# EasyEDA Pro project TF_MUX.epro, board PCB5
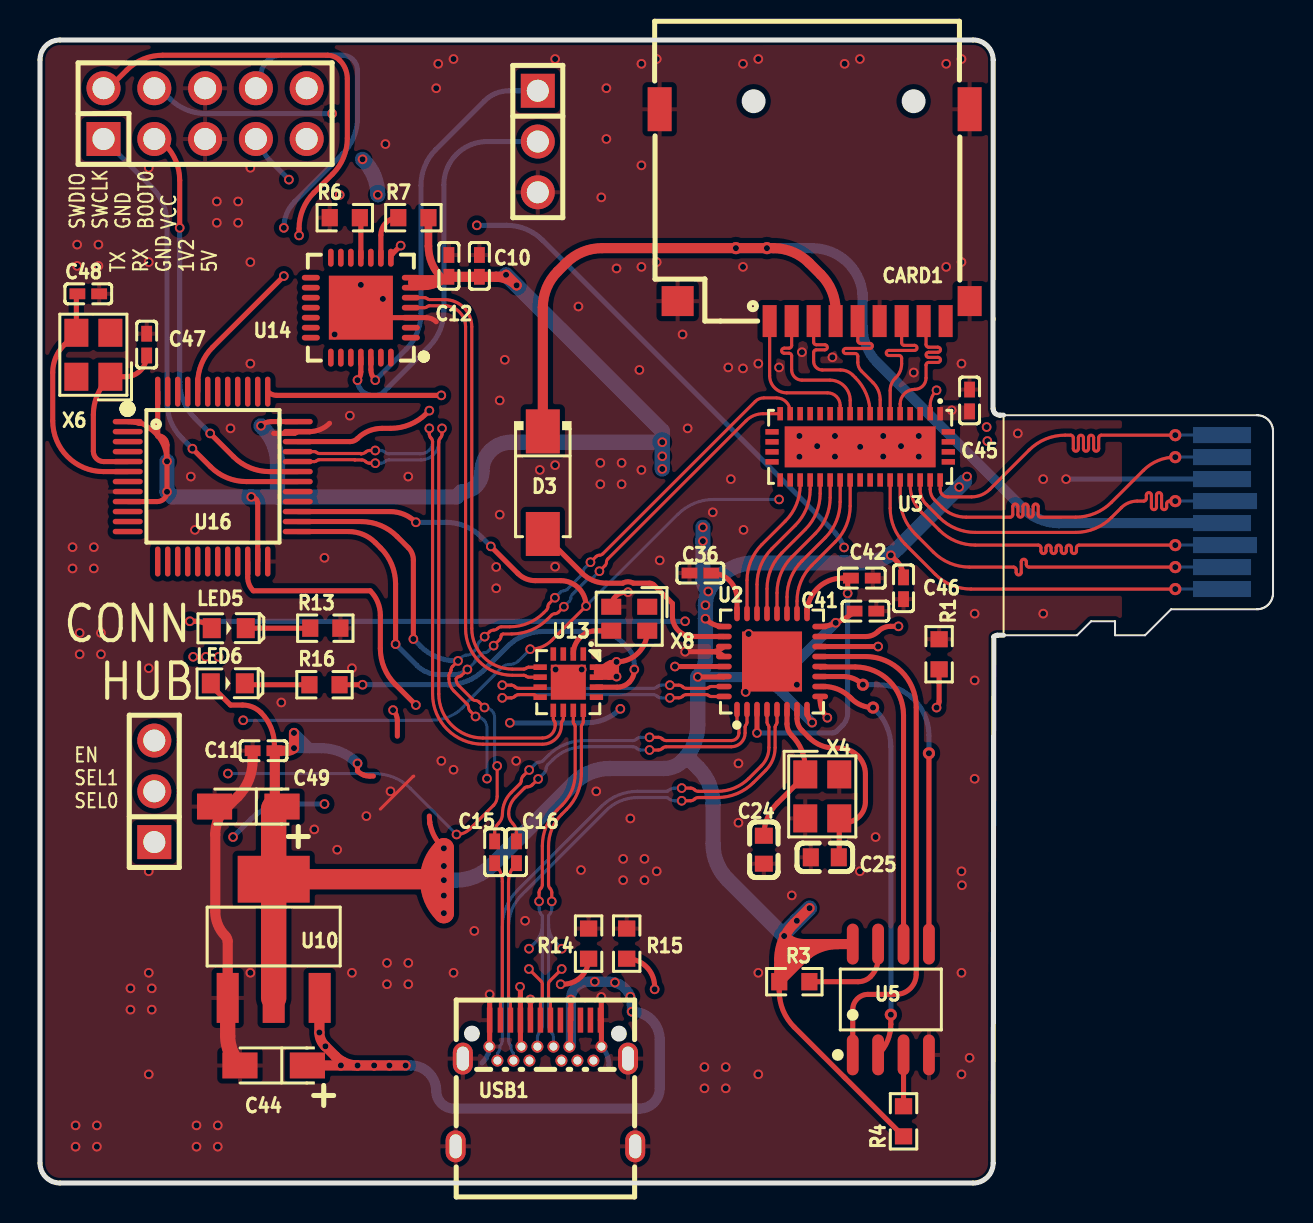
[diagram p1: board, top side]
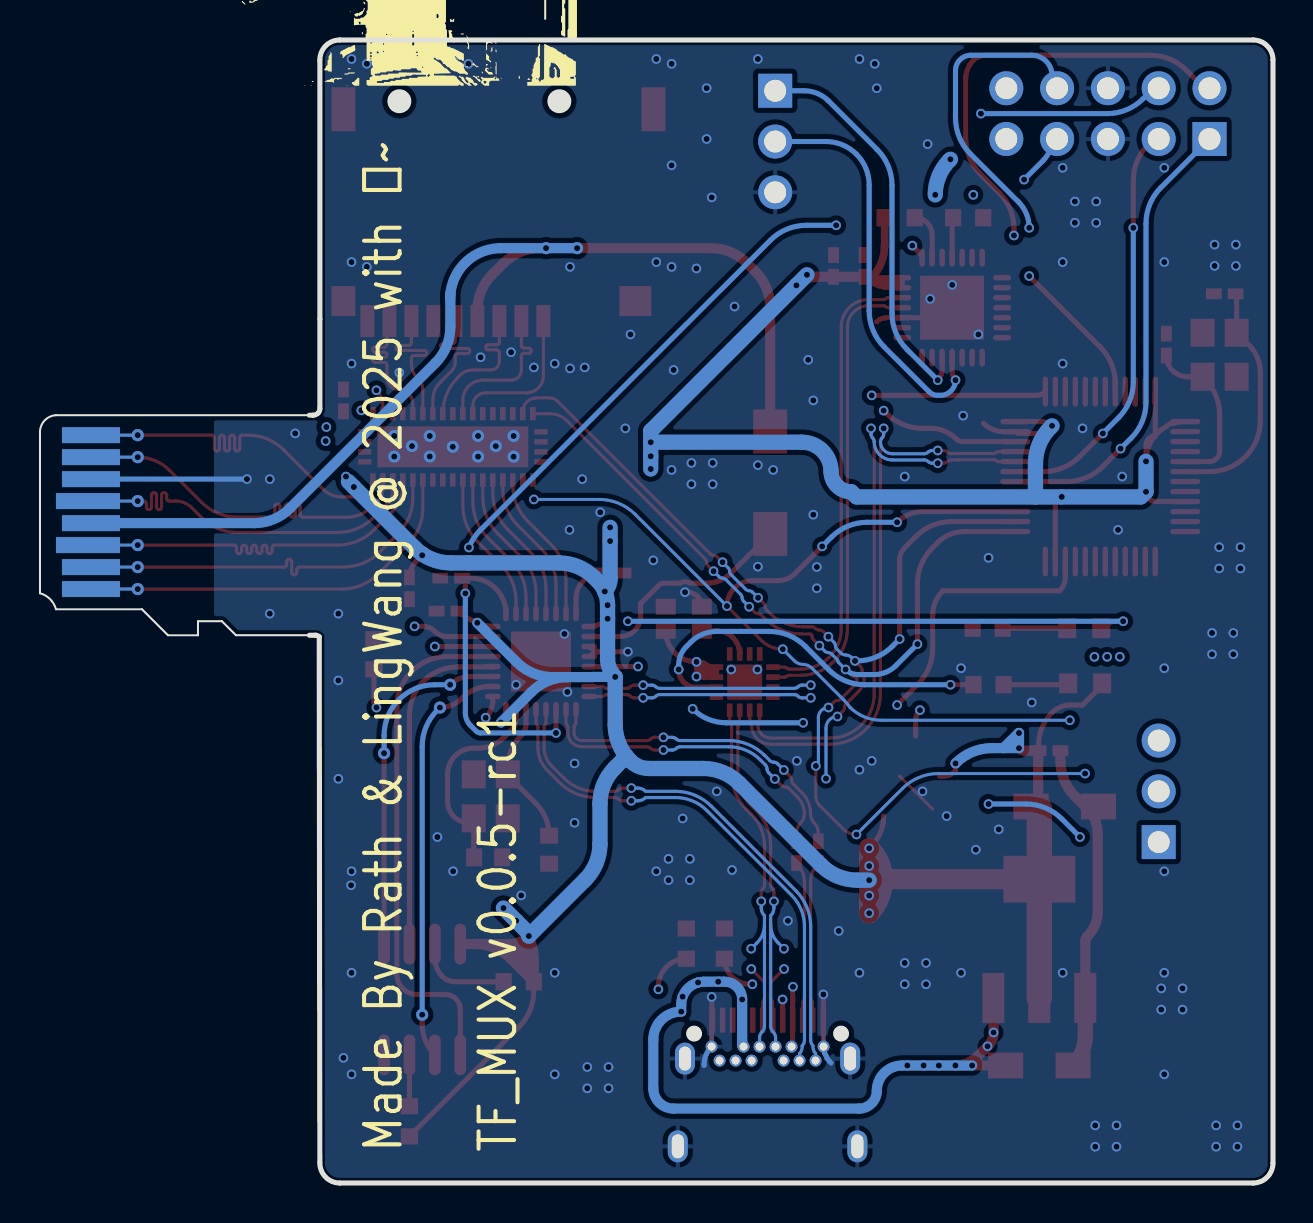
[diagram p2: board, bottom side, seen from below]

Outline 61.66 x 57.19 mm; copper layers: Top Layer, Inner1, Inner2, Bottom Layer. Coordinates in mm from the lower left corner of the outline.
Outline path: 48.18,38.42 48,38.42 arc(47.87,38.44) 47.75,38.52 arc(47.68,38.62) 47.66,38.75 47.66,43.23 47.66,56.19 arc(47.37,56.9) 46.66,57.19 1,57.19 arc(0.29,56.9) 0,56.19 0,1 arc(0.29,0.29) 1,0 46.66,0 arc(47.37,0.29) 47.66,1 47.69,27.33 arc(47.78,27.39) 47.88,27.41 48.18,27.41
Stack: Top Layer 0.035mm 外层铜厚1oz / Dielectric1 0.2104mm 7628 RC49% 8.6mil / Inner1 0.0152mm 内层铜厚 / Dielectric2 1.065mm 1.1mm H/HOZ Copper / Inner2 0.0152mm 内层铜厚 / Dielectric3 0.2104mm 7628 RC49% 8.6mil / Bottom Layer 0.035mm 外层铜厚1oz

## Design rules (mm)
net $1N466: DP1
net RD_TX+: RD_TX
net $1N465: DP1
net RD_TX-: RD_TX
net RD_RX+: RD_RX
net RD_RX-: RD_RX
net RD_D-: RD_D
net RD_D+: RD_D
net HS_D-: HS_D
net HS_D+: HS_D
net SER_D-: SER_D
net SER_D+: SER_D
net UP_D-: UP_D
net UP_D+: UP_D
net UP_RX2-: UP_RX2
net UP_RX2+: UP_RX2
net UP_TX2+: UP_TX2
net UP_TX2-: UP_TX2
template: 自定义配置
spacing copperThickness1oz (default): track to track 0.102, other pairs 0.152 to 0.3
spacing copperThickness2oz: track to track 0.203, other pairs 0.152 to 0.3
track width copperThickness1oz (default): min 0.127, default 0.254, max 2.54
track width copperThickness2oz: min 0.203, default 0.254, max 2.54
track width TFP: min 0.157, default 0.157, max 0.157
differential pair differentialPair (default): width min 0.127, default 0.157, max 2.54; gap min 0.152, default 0.152
via viaSize (default): diameter min 0.483, default 0.483, max 10; hole min 0.3, default 0.305, max 6.299
net TF_DAT1 uses TFP, TF_MUX
net TF_DAT0 uses TFP, TF_MUX
net TF_CLK uses TFP, TF_MUX
net TF_CMD uses TFP, TF_MUX
net TF_DAT3 uses TFP, TF_MUX
net TF_DAT2 uses TFP, TF_MUX
net UP_DAT1 uses MUX_TS, TFP
net UP_DAT0 uses MUX_TS, TFP
net UP_CLK uses MUX_TS, TFP
net UP_CMD uses MUX_TS, TFP
net UP_DAT3 uses MUX_TS, TFP
net UP_DAT2 uses MUX_TS, TFP
net TS_DAT1 uses MUX_DUT, TFP
net TS_DAT0 uses MUX_DUT, TFP
net TS_CLK uses MUX_DUT, TFP
net TS_CMD uses MUX_DUT, TFP
net TS_DAT3 uses MUX_DUT, TFP
net TS_DAT2 uses MUX_DUT, TFP

## Placement (name value [footprint] x y rotation side)
C10  0.1u  [C0402]  21.97 45.89 90 top
C11  0.1u  [C0402]  11.18 21.63 180 top
C12  0.1u  [C0402]  20.45 45.89 270 top
C15  0.1u  [C0402]  22.73 16.55 90 top
C16  0.1u  [C0402]  23.83 16.55 90 top
C24  12p  [C0603]  36.2 16.68 270 top
C25  12p  [C0603]  39.24 16.3 180 top
C36  0.1u  [C0402]  33.02 30.52 180 top
C41  0.1u  [C0402]  41.28 28.61 0 top
C42  0.1u  [C0402]  41.1 30.27 180 top
C44  10uF  [CAP-SMD_L3.2-W1.6-RD-C7171]  11.68 5.88 180 top
C45  0.1u  [C0402]  46.48 39.16 270 top
C46  0.1u  [C0402]  43.18 29.76 90 top
C47  20pF  [C0402]  5.33 41.95 90 top
C48  20pF  [C0402]  2.41 44.49 0 top
C49  10uF  [CAP-SMD_L3.2-W1.6-RD-C7171]  10.41 18.84 180 top
CARD1  TF PUSH  [TF-SMD_TF-PUSH]  38.74 48.43 180 top
D3  SS14  [SMA_L4.2-W2.6-LS5.3-RD]  25.14 35.04 270 top
H2  -  [HDR-TH_3P-P2.54-V-M]  24.89 52.11 270 top
H3  -  [HDR-TH_10P-P2.54-V-M-R2-C5-S2.54]  8.26 53.51 0 top
H4  -  [HDR-TH_3P-P2.54-V-M]  5.72 19.6 90 top
LED5  LED-0603_R  [LED0603_RED]  9.44 27.76 0 top
LED6  LED-0603_R  [LED0603_RED]  9.39 25 0 top
R1  1k  [R0603]  44.96 26.46 270 top
R3  1k  [R0603]  37.72 10.07 180 top
R4  1k  [R0603]  43.18 3.09 90 top
R6  10k  [R0603]  15.24 48.3 0 top
R7  4.7k  [R0603]  18.67 48.3 0 top
R13  1k  [R0603]  14.27 27.76 0 top
R14  5.1K  [R0603]  27.43 11.98 90 top
R15  5.1K  [R0603]  29.34 11.98 90 top
R16  1k  [R0603]  14.22 24.93 180 top
U2  GL3224-OIY04  [HQFN-32_L5.0-W5.0-P0.50-BL-EP3.0]  36.6 26.09 0 top
U3  TS3DV642A0RUAR  [WFQFN-42_L9.0-W3.5-P0.50-BL-EP]  41.01 36.83 180 top
U5  W25X05CLSNIG  [SOIC-8_L4.9-W3.9-P1.27-LS6.0-BL]  42.55 9.18 0 top
U9  TF卡插头  [TF卡封装]  59.18 33.57 180 top
U10  AMS1117-3.3  [SOT-223-3_L6.5-W3.4-P2.30-LS7.0-BR]  11.68 12.23 270 top
U13  CH334P  [QFN-16_L3.0-W3.0-P0.50-BL-EP1.7]  26.42 25.06 180 top
U14  CP2102-GMR  [WQFN-28_L5.0-W5.0-P0.50-BL-EP3.2]  16.04 43.8 90 top
U16  STM32F103C8T6  [LQFP-48_L7.0-W7.0-P0.50-LS9.0-BL]  8.64 35.35 270 top
USB1  TYPE-C 24P QCHT  [TYPE-C-SMD_TYPE-C-24P-QCHT]  25.27 4.99 0 top
X4  25MHz  [CRYSTAL-SMD_4P-L3.2-W2.5-BL]  39.12 19.34 270 top
X6  12MHz  [CRYSTAL-SMD_4P-L3.2-W2.5-BL]  2.67 41.44 90 top
X8  12MHz  [OSC-SMD_4P-L2.0-W1.6-BL]  29.46 28.23 180 top

## Footprints (pads in the part's own frame, mm; a bottom-side part is the same pattern mirrored in y, then rotated)
C0402
  rect 0.79x0.54 smd: 1(-0.545,0) 2(0.545,0)
C0603
  rect 0.8x0.9 smd: 1(-0.7,0) 2(0.7,0)
CAP-SMD_L3.2-W1.6-RD-C7171
  rect 1.758x1.296 smd: 1(-1.687,0) 2(1.687,0)
CRYSTAL-SMD_4P-L3.2-W2.5-BL
  rect 1.4x1.2 smd: 1(-1.1,-0.85) 2(1.1,-0.85) 3(1.1,0.85) 4(-1.1,0.85)
HDR-TH_3P-P2.54-V-M
  rect 1.7x1.7 hole 1.1: 1(-2.54,0)
  round 1.7 hole 1.1: 2(0,0) 3(2.54,0)
HDR-TH_10P-P2.54-V-M-R2-C5-S2.54
  rect 1.7x1.7 hole 1.1: 1(-5.08,-1.27)
  round 1.7 hole 1.1: 2(-5.08,1.27) 3(-2.54,-1.27) 4(-2.54,1.27) 5(0,-1.27) 6(0,1.27) 7(2.54,-1.27) 8(2.54,1.27) 9(5.08,-1.27) 10(5.08,1.27)
HQFN-32_L5.0-W5.0-P0.50-BL-EP3.0
  oval 0.28x0.785 smd: 1(-1.75,-2.408) 2(-1.25,-2.408) 3(-0.75,-2.408) 4(-0.25,-2.408) 5(0.25,-2.408) 6(0.75,-2.408) 7(1.25,-2.408) 8(1.75,-2.408) 17(1.75,2.408) 18(1.25,2.408) 19(0.75,2.408) 20(0.25,2.408) 21(-0.25,2.408) 22(-0.75,2.408) 23(-1.25,2.408) 24(-1.75,2.408)
  oval 0.785x0.28 smd: 9(2.408,-1.75) 10(2.408,-1.25) 11(2.408,-0.75) 12(2.408,-0.25) 13(2.408,0.25) 14(2.408,0.75) 15(2.408,1.25) 16(2.408,1.75) 25(-2.408,1.75) 26(-2.408,1.25) 27(-2.408,0.75) 28(-2.408,0.25) 29(-2.408,-0.25) 30(-2.408,-0.75) 31(-2.408,-1.25) 32(-2.408,-1.75)
  rect 3x3 smd: 33(0,0)
LED0603_RED
  rect 0.9x1 smd: 1(-0.85,0) 2(0.85,0)
LQFP-48_L7.0-W7.0-P0.50-LS9.0-BL
  oval 0.27x1.5 smd: 1(-2.75,-4.25) 2(-2.25,-4.25) 3(-1.75,-4.25) 4(-1.25,-4.25) 5(-0.75,-4.25) 6(-0.25,-4.25) 7(0.25,-4.25) 8(0.75,-4.25) 9(1.25,-4.25) 10(1.75,-4.25) 11(2.25,-4.25) 12(2.75,-4.25) 25(2.75,4.25) 26(2.25,4.25) 27(1.75,4.25) 28(1.25,4.25) 29(0.75,4.25) 30(0.25,4.25) 31(-0.25,4.25) 32(-0.75,4.25) 33(-1.25,4.25) 34(-1.75,4.25) 35(-2.25,4.25) 36(-2.75,4.25)
  oval 1.5x0.27 smd: 13(4.25,-2.75) 14(4.25,-2.25) 15(4.25,-1.75) 16(4.25,-1.25) 17(4.25,-0.75) 18(4.25,-0.25) 19(4.25,0.25) 20(4.25,0.75) 21(4.25,1.25) 22(4.25,1.75) 23(4.25,2.25) 24(4.25,2.75) 37(-4.25,2.75) 38(-4.25,2.25) 39(-4.25,1.75) 40(-4.25,1.25) 41(-4.25,0.75) 42(-4.25,0.25) 43(-4.25,-0.25) 44(-4.25,-0.75) 45(-4.25,-1.25) 46(-4.25,-1.75) 47(-4.25,-2.25) 48(-4.25,-2.75)
OSC-SMD_4P-L2.0-W1.6-BL
  rect 1x0.8 smd: 1(-0.9,-0.6) 2(0.9,-0.6) 3(0.9,0.6) 4(-0.9,0.6)
QFN-16_L3.0-W3.0-P0.50-BL-EP1.7
  rect 0.28x0.665 smd: 1(-0.75,-1.407) 2(-0.25,-1.407) 3(0.25,-1.407) 4(0.75,-1.407) 9(0.75,1.407) 10(0.25,1.407) 11(-0.25,1.407) 12(-0.75,1.407)
  rect 0.665x0.28 smd: 5(1.407,-0.75) 6(1.407,-0.25) 7(1.407,0.25) 8(1.407,0.75) 13(-1.407,0.75) 14(-1.407,0.25) 15(-1.407,-0.25) 16(-1.407,-0.75)
  rect 1.75x1.75 smd: 17(0,0)
R0603
  rect 0.806x0.864 smd: 1(-0.753,0) 2(0.753,0)
SMA_L4.2-W2.6-LS5.3-RD
  rect 2.2x1.7 smd: 1(-2.566,0) 2(2.566,0)
SOIC-8_L4.9-W3.9-P1.27-LS6.0-BL
  oval 0.588x2.045 smd: 1(-1.905,-2.772) 2(-0.635,-2.772) 3(0.635,-2.772) 4(1.905,-2.772) 5(1.905,2.772) 6(0.635,2.772) 7(-0.635,2.772) 8(-1.905,2.772)
SOT-223-3_L6.5-W3.4-P2.30-LS7.0-BR
  rect 2.5x1.1 smd: 1(2.97,-2.3) 2(2.97,0) 3(2.97,2.3)
  rect 2.34x3.6 smd: 4(-2.97,0)
TF-SMD_TF-PUSH
  rect 0.7x1.6 smd: 1(2.25,5.3) 2(1.15,5.3) 3(0.05,5.3) 4(-1.05,5.3) 5(-2.15,5.3) 6(-3.25,5.3) 7(-4.35,5.3) 8(-5.45,5.3) CD(-6.55,5.3)
  rect 1.2x1.5 smd: 10(-7.75,4.3)
  rect 1.2x2.2 smd: 11(-7.75,-5.3) 12(7.75,-5.3)
  rect 1.6x1.5 smd: 13(6.85,4.3)
TF卡封装
  rect 2.9x0.8 smd far side: 1(0.075,3.85) 2(0.074,2.751) 4(0.075,0.551) 6(0.074,-1.651) 7(0.074,-2.751) 8(0.074,-3.85)
  rect 3.2x0.8 smd far side: 3(-0.074,1.65) 5(-0.075,-0.551)
TYPE-C-SMD_TYPE-C-24P-QCHT
  oval 1x1.6 hole 0.6x1.2: 25(-4.49,-3.158) 25(-4.13,1.232) 25(4.13,1.232) 25(4.49,-3.158)
  rect 0.275x1.25 smd: A1(-2.79,3.158) A2(-2.25,3.158) A3(-1.75,3.158) A4(-1.25,3.158) A5(-0.75,3.158) A6(-0.25,3.158) A7(0.25,3.158) A8(0.75,3.158) A9(1.25,3.158) A10(1.75,3.158) A11(2.25,3.158) A12(2.75,3.158)
  round 0.6 hole 0.4: B1(2.8,1.833) B2(2.401,1.133) B3(1.601,1.133) B4(1.2,1.833) B5(0.8,1.133) B6(0.401,1.833) B7(-0.4,1.833) B8(-0.8,1.133) B9(-1.2,1.833) B10(-1.599,1.133) B11(-2.4,1.133) B12(-2.8,1.833)
WFQFN-42_L9.0-W3.5-P0.50-BL-EP
  rect 0.28x0.665 smd: 1(-3.998,-1.657) 2(-3.498,-1.657) 3(-2.998,-1.657) 4(-2.498,-1.657) 5(-1.998,-1.657) 6(-1.498,-1.657) 7(-0.998,-1.657) 8(-0.497,-1.657) 9(0.003,-1.657) 10(0.502,-1.657) 11(1.002,-1.657) 12(1.502,-1.657) 13(2.002,-1.657) 14(2.502,-1.657) 15(3.002,-1.657) 16(3.502,-1.657) 17(4.003,-1.657) 22(4.003,1.657) 23(3.502,1.657) 24(3.002,1.657) 25(2.502,1.657) 26(2.002,1.657) 27(1.502,1.657) 28(1.002,1.657) 29(0.502,1.657) 30(0.003,1.657) 31(-0.497,1.657) 32(-0.998,1.657) 33(-1.498,1.657) 34(-1.998,1.657) 35(-2.498,1.657) 36(-2.998,1.657) 37(-3.498,1.657) 38(-3.998,1.657)
  rect 0.665x0.28 smd: 18(4.41,-0.75) 19(4.41,-0.25) 20(4.41,0.25) 21(4.41,0.75) 39(-4.405,0.75) 40(-4.405,0.25) 41(-4.405,-0.25) 42(-4.405,-0.75)
  rect 7.55x2.05 smd: 43(0.003,0)
WQFN-28_L5.0-W5.0-P0.50-BL-EP3.2
  oval 0.28x0.9 smd: 1(-1.501,-2.5) 2(-1.001,-2.5) 3(-0.5,-2.5) 4(0,-2.5) 5(0.5,-2.5) 6(1,-2.5) 7(1.501,-2.5) 15(1.501,2.5) 16(1,2.5) 17(0.5,2.5) 18(0,2.5) 19(-0.5,2.5) 20(-1.001,2.5) 21(-1.501,2.5)
  oval 0.9x0.28 smd: 8(2.5,-1.502) 9(2.5,-1.001) 10(2.5,-0.5) 11(2.5,-0.001) 12(2.5,0.5) 13(2.5,1) 14(2.5,1.501) 22(-2.5,1.501) 23(-2.5,1) 24(-2.5,0.5) 25(-2.5,-0.001) 26(-2.5,-0.5) 27(-2.5,-1.001) 28(-2.5,-1.502)
  rect 3.2x3.2 smd: 29(0,-0.001)

## Nets
As in the schematic.

Pads without a net: CARD1 CD; U3 3 4 9 12 13 14 15 18 19 20 21 22 23 30 31 32 39 40 41 42; U13 1 3 4 13; U14 1 2 10 12 13 14 15 16 17 18 19 20 21 22 23 24 27 28; U16 2 3 4 7 10 11 12 16 17 18 19 20 21 28 29 38 39 40 41 42 43 45 46; USB1 A8 B8; X6 2 4; X8 1

## Via types
v1: diameter 0.482, hole 0.305, Top Layer to Bottom Layer, 289 vias
v2: diameter 0.61, hole 0.305, Top Layer to Bottom Layer, 23 vias

## Routing (per net, layer and track width the routed paths; a pad name or vN(x,y) marks a point on that pad's centre or on a via; arc(x,y) is an arc through that point)
1V2: length 56.4
  Top Layer w0.254: U2.3 v1(35.85,22.52) ; 40.32,30.27 C42.2 ; 40.32,30.27 40.12,30.27 arc(38.87,29.75) U2.17 ; 40.32,30.27 arc(40.37,30.2) 40.39,30.11 v1(40.39,29.5)
  Inner2 w0.254: v1(12.45,50.2) 18.51,50.2 arc(19.48,50.01) 20.3,49.46 v1(21.84,47.92) ; v1(40.39,29.5) 40.39,30.86 arc(40.34,31.34) v1(40.21,31.8)
  Bottom Layer w0.254: v1(21.84,47.92) 23.33,47.92 arc(24.3,47.73) 25.13,47.17 39.64,32.66 arc(39.97,32.26) v1(40.21,31.8) ; v1(12.45,50.2) 11.5,51.15 arc(11.17,51.65) 11.05,52.24 ; v1(40.39,29.5) 40.39,23.51 arc(40.32,23.18) 40.13,22.9 39.84,22.61 arc(39.74,22.54) 39.62,22.52 v1(35.85,22.52)
+5V: length 157.6
  Top Layer w0.254: U2.15 41.29,27.34 arc(41.63,27.41) 41.91,27.6 arc(42.19,27.79) 42.52,27.85 v1(42.93,27.85) ; v1(26.54,9.18) 26.54,8.17 arc(26.54,8.16) USB1.A9 26.52,6.88 arc(26.51,6.84) USB1.B4 ; v1(18.03,46.9) 17.63,46.49 arc(17.57,46.4) U14.8 ; v1(24,9.82) arc(24.02,9.81) 24.02,9.8 24.02,9.33 arc(24,9.18) 24.02,9.04 USB1.A4 24.02,6.88 arc(24.04,6.84) USB1.B9
  Top Layer w0.508: C44.1 v1(15.05,5.88) v1(15.88,5.88) ; v1(15.88,5.88) v1(16.71,5.88) v1(17.47,5.88) v1(18.28,5.88) ; v1(15.88,5.88) arc(15.5,5.93) 15.14,6.07 arc(14.95,6.19) 14.77,6.34 v1(14.27,6.84) 14.25,6.87 arc(14.04,7.17) v1(13.97,7.53) 13.97,9.23 arc(13.97,9.25) U10.3
  Inner2 w0.508: USB1.B9 arc(23.93,6.88) 23.88,7.02 23.88,9.69 arc(23.91,9.78) v1(24,9.82)
  Inner2 w0.762: v1(16.89,49.44) 17.29,49.04 arc(17.84,48.22) 18.03,47.25 v1(18.03,46.9) 18.03,44.14 arc(18.23,43.17) 18.78,42.35 20.96,40.17 20.96,29.16 arc(20.76,28.19) 20.21,27.36 12.94,20.09 arc(12.39,19.26) 12.19,18.29 12.19,10.36 arc(12.39,9.39) 12.94,8.57 v1(13.97,7.53) ; v1(18.28,5.88) v1(17.47,5.88) ; v1(17.47,5.88) v1(16.71,5.88) v1(15.88,5.88) v1(15.05,5.88) 14.56,6.37 arc(14.39,6.59) v1(14.27,6.84) arc(14.11,7.18) 13.99,7.53 arc(13.97,7.66) 13.97,7.79 ; v1(17.47,5.88) arc(17.52,5.89) 17.57,5.92 20.32,8.68 21.92,8.68 arc(22.08,8.64) 22.23,8.55 arc(22.61,8.3) 23.05,8.21 26.44,8.21 arc(26.49,8.23) 26.51,8.27 ; H3.9 14.06,52.24 arc(15.03,52.04) 15.86,51.49 v1(16.13,51.22) ; v1(42.93,27.85) 45.67,25.11 arc(45.8,24.91) 45.85,24.68 45.85,19.89 arc(45.65,18.92) 45.1,18.09 37.08,10.07 arc(36.26,9.52) 35.28,9.32 32.51,9.32 32.51,9.32 arc(31.68,8.77) 30.71,8.58 v1(29.59,8.58) arc(29.55,8.93) 29.42,9.27 arc(29.12,9.67) 28.71,9.94 arc(28.48,10.02) 28.24,10.07 arc(28.09,10.09) 27.93,10.07 v1(27.74,10.07) 27.43,10.07 arc(27.09,10) 26.8,9.81 arc(26.72,9.57) 26.57,9.38 arc(26.55,9.28) v1(26.54,9.18) arc(26.52,9.14) 26.51,9.09 26.51,8.27 ; 26.51,8.27 26.51,6.87
  Bottom Layer w0.508: v1(15.05,5.88) v1(15.88,5.88) v1(16.71,5.88) v1(17.47,5.88) v1(18.28,5.88) 18.54,5.88 arc(19.44,5.51) 19.81,4.61 arc(20.07,3.98) 20.7,3.72 29.97,3.72 arc(30.69,4.02) 30.99,4.74 30.99,7.18 arc(30.58,8.17) v1(29.59,8.58) 29.59,8.93 arc(29.57,9.13) v1(29.52,9.32) arc(29.22,9.77) v1(28.75,10.03) arc(28.6,10.06) 28.45,10.07 v1(27.74,10.07) 27.43,10.07 arc(26.8,9.81) v1(26.54,9.18) 26.54,6.9 arc(26.52,6.85) USB1.B4
  Bottom Layer w0.762: v1(16.13,51.22) 16.17,51.18 arc(16.7,50.38) v1(16.89,49.44)
GND: length 45.2
  Top Layer w0.152: 17.02,18.71 18.66,20.35 arc(18.67,20.36) 18.69,20.36
  Top Layer w0.254: v1(22.48,9.44) USB1.A1 22.48,6.84 arc(22.48,6.83) USB1.B12 ; 33.57,26.58 33.62,26.58 arc(33.93,26.52) U2.28 ; 33.57,26.58 v1(32.26,26.58) ; 33.57,26.58 arc(33.91,26.65) U2.27 ; v1(29.4,29.56) 29.29,29.56 arc(28.78,29.35) X8.2 ; 11.68,37.5 12.2,37.5 arc(12.24,37.51) 12.27,37.51 12.73,37.51 arc(12.81,37.54) U16.35 13.47,37.6 arc(14.02,37.7) 14.48,38.01 ; USB1.B1 28.07,8.1 arc(28.06,8.14) USB1.A12 arc(28.05,8.16) 28.07,8.19 v1(28.07,9.31) ; 19.81,43.09 arc(19.59,43.24) 19.32,43.3 U14.3 17.25,43.3 arc(16.6,43.43) U14.29
  Top Layer w0.508: U10.1 9.38,12.09 arc(9.36,12.23) 9.27,12.36 arc(8.9,12.92) 8.76,13.59 8.76,17.44 arc(8.85,18.02) 9.1,18.55 ; C11.2 10.63,21.13 arc(10.44,20.16) 9.89,19.33 9.1,18.55 ; 9.1,18.55 arc(9.22,18.7) 9.34,18.84
  Top Layer w0.762: U10.1 9.38,7.36 arc(9.54,6.56) C44.2
  Bottom Layer w0.254: v1(51.31,35.22) U9.6 ; 28.45,5.88 28.45,5.92 arc(28.35,6.41) USB1.B1 ; 22.1,6.01 22.16,6.07 arc(22.24,6.16) 22.31,6.26 arc(22.35,6.38) 22.42,6.48 arc(22.46,6.65) USB1.B12
  vias: v1(1.63,31.81) v1(1.63,30.75) v1(1.78,2.88) v1(1.78,1.82) v1(1.86,46.95) v1(1.86,45.89) v1(1.98,27.52) v1(1.98,26.46) v1(2.69,31.81) v1(2.69,30.75) v1(2.84,2.88) v1(2.84,1.82) v1(2.92,46.95) v1(2.92,45.89) v1(3.05,27.52) v1(3.05,26.46) v1(4.52,9.74) v1(4.52,8.68) v1(5.44,50.8) v1(5.44,46.08) v1(5.44,25.76) v1(5.44,15.6) v1(5.44,10.52) v1(5.44,5.44) v1(5.59,9.74) v1(5.59,8.68) v1(7.54,35.35) v1(7.75,32.68) v1(7.83,2.88) v1(7.83,1.82) v1(8.84,49.11) v1(8.84,48.05) v1(8.89,2.88) v1(8.89,1.82) v1(9.53,37.76) v1(9.91,49.11) v1(9.91,48.05) v1(10.52,50.8) v1(10.52,46.08) v1(10.52,41) v1(10.52,10.52) v1(12.07,24.04) v1(13.72,17.69) v1(14.22,31.28) v1(14.73,42.46) v1(14.86,16.68) v1(15.49,38.39) v1(15.6,25.76) v1(15.6,10.52) v1(16.04,44.94) v1(16.32,18.36) v1(17.15,44.24) v1(17.27,51.98) v1(17.35,11.01) v1(17.35,9.95) v1(17.53,19.6) v1(18.42,35.35) v1(18.42,11.01) v1(18.42,9.95) v1(19.81,54.78) v1(19.91,56) v1(20.07,21.12) v1(20.68,56.24) v1(20.68,20.68) v1(20.68,10.52) v1(21.72,12.61) v1(22.81,30.82) v1(22.81,29.76) v1(22.99,39.16) v1(22.99,33.44) v1(23.24,41.19) v1(23.81,21.12) v1(24.26,13.12) v1(24.99,35.68) v1(25.76,56.24) v1(25.76,35.92) v1(25.76,30.84) v1(25.78,25.69) v1(26.92,43.86) v1(27.09,25.69) v1(27.05,15.66) v1(27.81,19.6) v1(28.02,36.03) v1(28.02,34.97) v1(28.07,49.32) v1(28.32,54.78) v1(28.32,52.24) v1(28.83,45.76) v1(29.08,36.03) v1(29.08,34.97) v1(29.16,16.22) v1(29.16,15.15) v1(29.52,18.24) v1(29.97,40.68) v1(30.07,56) v1(30.07,50.92) v1(30.07,45.84) v1(30.07,35.68) v1(30.23,16.22) v1(30.23,15.15) v1(30.84,56.24) v1(30.84,46.08) v1(30.84,15.6) v1(30.99,31.16) v1(32.13,42.46) v1(32.39,37.76) v1(33.23,5.8) v1(33.23,4.74) v1(33.64,33.56) v1(34.29,5.8) v1(34.29,4.74) v1(34.42,40.81) v1(34.54,35.22) v1(34.93,21) v1(34.93,18.03) v1(35.15,56) v1(35.15,45.84) v1(35.15,40.76) v1(35.18,32.68) v1(35.29,24.57) v1(35.43,27.47) v1(35.92,56.24) v1(35.92,41) v1(35.92,10.52) v1(35.92,5.44) v1(36.96,40.81) v1(37.59,14.39) v1(37.85,24.93) v1(38.1,41.57) v1(39.62,41.31) v1(40.23,56) v1(41,56.24) v1(41,15.6) v1(41.78,17.31) v1(43.69,40.55) v1(45.31,56) v1(45.31,45.84) v1(46.08,56.24) v1(46.08,46.08) v1(46.08,41) v1(46.08,15.6) v1(46.1,14.9) v1(46.08,10.52) v1(46.08,5.44) v1(46.48,6.26) v1(46.74,28.49) v1(46.74,25.15) v1(46.74,20.22) v1(48.9,37.5) v1(50.17,35.22) v1(50.17,28.49) v2(37.97,37.38) v2(37.97,36.34) v2(38.86,36.87) v2(39.75,37.38) v2(39.75,36.35) v2(41.01,36.83) v2(42.16,37.38) v2(42.16,36.35) v2(43.05,36.87) v2(43.94,37.38) v2(43.94,36.35)
VCC: length 303
  Top Layer w0.254: 28.45,25.31 U13.15 27.82,25.55 ; 28.45,25.31 28.27,25.48 ; 28.45,25.31 28.75,25.31 arc(28.8,25.32) v1(28.83,25.34) ; 28.45,25.31 28.45,25.69 ; 28.45,25.31 arc(28.59,25.52) 28.64,25.78 28.64,25.88 ; X8.4 30.36,27.61 arc(29.91,26.52) v1(28.83,26.08) ; 16.67,20.36 16.49,20.36 arc(16.39,20.37) 16.3,20.38 arc(16.24,20.39) 16.18,20.42 arc(16.02,20.5) 15.88,20.61 v1(15.88,21) ; R4.1 40.27,5.25 arc(40.24,5.28) 40.2,5.31 37.71,7.81 arc(37.16,8.63) 36.97,9.6 R3.2 ; U16.23 10.89,34.01 arc(10.79,34.24) v1(10.56,34.33) ; 28.51,26.02 28.58,25.95 arc(28.61,25.92) 28.64,25.88 ; 28.51,26.02 arc(28.66,26.06) 28.81,26.08 v1(28.83,26.08) ; 28.51,26.02 arc(28.33,25.93) 28.17,25.81 ; 28.27,25.48 28.04,25.72 arc(27.94,25.79) U13.16 ; 28.27,25.48 arc(28.2,25.53) 28.12,25.55 27.82,25.55 ; 5.89,37.4 5.89,37.39 ; 5.89,37.4 U16.48 ; 5.89,37.4 arc(5.89,37.4) 5.89,37.39 ; 5.89,37.4 arc(5.63,37.66) 5.32,37.86 arc(5.18,37.97) 5,38.01 4.96,38.01 arc(4.68,38.07) U16.1 ; 5.89,37.39 arc(5.89,37.39) 5.89,37.39 ; 5.89,37.39 arc(5.9,37.36) 5.93,37.35 ; 6.35,36.13 v1(6.35,36.11) v1(6.35,34.58) arc(6.21,34.24) 5.86,34.1 U16.9 ; 6.35,36.13 6.35,36.93 arc(6.22,37.25) 5.89,37.39 ; 6.35,36.13 arc(6.24,36.78) 5.93,37.35 ; 28.64,25.88 28.45,25.69 ; 28.64,25.88 28.64,25.89 ; 28.64,25.88 arc(28.64,25.88) 28.64,25.88 ; 28.45,25.69 arc(28.32,25.78) 28.17,25.81 ; 28.45,25.69 arc(28.3,25.72) 28.17,25.81 ; U13.16 27.82,25.55 ; U13.16 28.17,25.81 ; U2.30 34.18,25.32 v1(32.89,25.32) ; C11.1 11.72,21.91 arc(11.55,22.79) 11.05,23.53 arc(10.63,23.82) 10.13,23.92 9.53,23.92 8.61,24.83 arc(8.56,24.91) LED6.1 ; v1(20.19,16.75) 20.1,16.84 arc(19.74,17.32) 19.53,17.87 arc(19.5,17.94) 19.49,18.01 19.49,18.07 arc(19.47,18.21) 19.47,18.36 ; v1(28.83,25.34) v1(28.83,26.08) ; v1(28.83,25.34) arc(28.78,25.62) 28.64,25.88 ; v1(28.83,26.08) 28.64,25.89 ; v1(42.55,31.41) 42.85,31.11 arc(43.09,30.74) C46.2 ; C41.1 40.63,28.51 arc(40.23,28.24) v1(39.79,28.03) arc(39.41,27.89) U2.16 ; U16.36 11.56,38.1 arc(11.28,38.04) v1(11.05,37.89) ; 18.54,45.06 18.54,45.3 20.34,45.3 arc(20.4,45.31) C12.2 ; 18.54,45.06 U14.6 19.14,44.8 arc(19.24,44.8) 19.34,44.81 ; 18.54,45.06 18.75,45.06 ; U2.8 38.35,23.64 arc(38.42,23.31) 38.61,23.03 ; 28.64,25.89 28.64,25.88 ; 17.87,22.36 17.87,23.14 arc(17.81,23.42) v1(17.65,23.66) ; 18.75,45.06 19.76,45.06 arc(20.13,45.13) C12.2 ; 18.75,45.06 arc(19.07,44.99) 19.34,44.81 ; v1(33.27,28.23) 33.29,28.22 arc(33.71,27.94) U2.25 ; 19.34,44.81 arc(19.94,44.98) C12.2 ; 5.93,37.35 arc(5.91,37.37) 5.89,37.39 ; 37.24,12.33 arc(37.22,12.35) v1(37.21,12.36)
  Top Layer w0.381: R7.2 19.42,46.88 arc(19.59,46.02) 20.08,45.3
  Top Layer w0.508: v1(37.21,12.36) 37.24,12.33 ; 37.24,12.33 37.51,12.06 ; 37.24,12.33 arc(37.68,12.05) 38.18,11.96 39.9,11.96 ; 37.24,12.33 arc(37.04,11.78) 36.97,11.19 36.97,10.89 ; 37.24,12.33 arc(37.24,12.34) 37.24,12.34 arc(37.45,12.68) 37.71,12.98 v1(38.48,13.76) ; 37.22,10.91 37.22,11.35 arc(37.3,11.73) 37.51,12.06 ; 37.22,10.91 arc(37.42,10.97) 37.61,11.05 ; 37.22,10.91 arc(37.09,10.89) 36.97,10.89 ; 37.51,12.06 37.85,11.72 arc(38.11,11.55) 38.43,11.48 ; 37.51,12.06 37.51,11.27 arc(37.54,11.15) 37.61,11.05 ; 36.97,10.89 R3.2 38.11,11.21 arc(38.26,11.35) 38.43,11.48 ; v1(12.7,22.52) v1(12.7,21.76) arc(12.56,21.66) 12.39,21.63 C11.1 arc(11.74,21.61) 11.74,21.58 11.74,18.84 ; 38.1,11.47 37.91,11.28 arc(37.76,11.15) 37.61,11.05 ; 39.9,11.96 U5.8 ; 39.9,11.96 arc(39.13,11.84) 38.43,11.48 ; 22.8,45.34 23.06,45.34 arc(23.19,45.37) v1(23.3,45.44) v1(23.83,44.91) arc(23.56,45.13) 23.25,45.27 arc(23.03,45.32) 22.8,45.34 ; 22.8,45.34 C10.1 C12.2
  Top Layer w1.016: 19.51,15.2 19.51,15.15 arc(19.69,14.26) v1(20.19,13.5) v1(20.19,14.38) v1(20.19,15.15) ; 19.51,15.2 20.08,15.2 arc(20.14,15.19) v1(20.19,15.15) ; 19.51,15.2 U10.4 ; 19.51,15.2 arc(19.67,16) 20.12,16.68 v1(20.19,16.75) v1(20.19,15.86) v1(20.19,15.15)
  Top Layer w1.27: U10.2 U10.4 11.68,18.7 arc(11.7,18.77) 11.74,18.84
  Inner1 w0.762: 16.89,22.01 18.94,19.96 arc(19.49,19.14) 19.69,18.16 19.69,17.69 arc(19.77,17.29) 19.99,16.95 v1(20.19,16.75) ; 16.89,22.01 17.02,22.14 arc(17.49,22.84) v1(17.65,23.66) ; 16.89,22.01 v1(15.88,21)
  Inner1 w1.016: v1(20.19,13.5) v1(20.19,14.38) v1(20.19,15.15) v1(20.19,15.86) v1(20.19,16.75)
  Inner2 w0.254: 33.27,29.26 arc(33.31,29.44) v1(33.42,29.6)
  Inner2 w0.508: 13.34,54.78 16.47,54.78 arc(17.45,54.58) 18.27,54.03 22.12,50.19 arc(22.67,49.36) 22.86,48.39 22.86,46.94 arc(22.98,46.16) 23.33,45.46 arc(23.46,45.3) 23.6,45.14 v1(23.83,44.91) ; v1(15.88,21) 17.02,22.14 arc(17.49,22.84) v1(17.65,23.66) ; v1(20.19,13.5) v1(20.19,14.38) v1(20.19,15.15) v1(20.19,15.86) ; v1(20.19,15.86) 20.87,15.86 arc(21.84,16.05) 22.66,16.61 25.78,19.72 25.78,21.24 arc(25.97,22.21) 26.53,23.04 v1(28.83,25.34) v1(28.83,26.08) ; v1(20.19,15.86) v1(20.19,16.75)
  Inner2 w0.762: 33.27,29.25 33.4,29.25 ; 33.27,29.25 32.07,29.25 arc(31.91,29.24) 31.76,29.2 arc(31.51,29.1) 31.31,28.93 29.1,26.73 arc(28.9,26.43) v1(28.83,26.08) ; 33.27,29.25 33.27,32.5 arc(33.24,32.67) v1(33.15,32.81) 31.74,34.21 arc(31.28,34.91) v1(31.12,35.73) v1(31.12,36.36) 31.12,36.87 ; 33.27,29.25 v1(33.27,28.91) v1(33.27,28.23) ; v1(45.59,38.66) 45.78,38.47 ; 45.78,38.47 46.95,37.3 arc(47.14,37.17) v1(47.37,37.12) ; 45.78,38.47 arc(46.49,37.99) v1(47.34,37.83) arc(47.36,37.79) 47.37,37.74 v1(47.37,37.12) ; v1(47.37,37.12) arc(47.21,36.3) 46.74,35.61 v1(45.96,34.82)
  Bottom Layer w0.254: 42.54,31.47 42.54,31.42 arc(42.54,31.41) v1(42.55,31.41)
  Bottom Layer w0.508: v1(38.61,23.04) 37.08,24.57 arc(36.26,25.12) 35.29,25.31 ; 35.29,25.31 36.02,25.31 arc(36.99,25.51) 37.82,26.06 v1(39.79,28.03) ; 35.29,25.31 34.04,25.31 arc(34.03,25.32) 34.01,25.32 v1(32.89,25.32) ; 13.48,21.76 14.06,21.76 arc(15.03,21.57) 15.86,21.02 v1(15.88,21) ; 13.48,21.76 v1(12.7,21.76) v1(12.7,22.52) arc(12.72,22.52) 12.73,22.51 13.48,21.76
  Bottom Layer w0.762: v1(38.48,13.76) v1(37.85,13.12) 37.3,12.58 arc(37.23,12.48) v1(37.21,12.36) 34.4,15.17 arc(33.85,15.99) 33.66,16.97 33.66,18.98 arc(33.46,19.95) 32.91,20.77 32.34,21.35 ; v1(31.12,37.07) v1(31.12,36.36) v1(31.12,35.73) ; v1(31.12,37.07) 31.12,37.63 v1(23.83,44.91) v1(23.3,45.44) ; v1(31.12,37.07) 23.56,37.07 arc(22.53,36.64) 22.1,35.6 arc(21.8,34.88) 21.08,34.58 20.83,34.33 11.88,34.33 ; 32.34,21.35 arc(32.25,21.24) 32.15,21.14 32.13,21.12 arc(31.71,20.84) 31.21,20.74 28.48,20.74 arc(27.51,20.55) 26.69,20 22.59,15.9 arc(21.76,15.35) 20.79,15.15 v1(20.19,15.15) ; 32.34,21.35 arc(32.75,22.09) 32.89,22.94 v1(32.89,25.32) arc(33.18,25.74) 33.27,26.24 v1(33.27,28.23) v1(33.27,28.91) arc(33.31,29.26) v1(33.42,29.6) ; 46.23,35.09 v1(45.96,34.82) 42.91,31.77 arc(42.73,31.61) 42.54,31.47 arc(42.53,31.46) 42.52,31.45 arc(41.85,31.14) 41.11,31.03 40.27,31.03 arc(40.21,31.03) 40.14,31.03 35.72,31.03 arc(34.75,30.83) 33.93,30.28 33.78,30.14 arc(33.57,29.89) v1(33.42,29.6) ; v1(6.35,36.11) v1(6.35,34.58) 6.6,34.33 v1(10.56,34.33) 11.88,34.33 ; 11.88,34.33 11.88,36 arc(11.68,36.98) 11.13,37.8 v1(11.05,37.89) ; v1(33.15,32.81) v1(33.15,32.12) 33.15,30.25 arc(33.22,29.9) v1(33.42,29.6)
  vias: v1(46.36,35.35)
25CLKIN: length 7.3
  Top Layer w0.254: U2.6 37.35,22.97 arc(37.42,22.66) 37.59,22.39 arc(38.09,21.65) 38.27,20.76 X4.1 arc(38.26,20.4) 38.23,20.37 36.87,19 arc(36.37,18.26) C24.1
25CLKOUT: length 10.5
  Top Layer w0.254: 39.97,18.02 X4.3 ; 39.97,18.02 39.97,16.35 arc(39.96,16.32) 39.94,16.3 ; 39.97,18.02 40.21,18.02 arc(40.96,18.34) 41.28,19.09 41.28,20.46 arc(41.18,20.95) 40.89,21.38 arc(40.47,21.66) 39.97,21.76 39.75,21.76 arc(39.05,21.9) 38.45,22.3 38.1,22.65 arc(37.92,22.92) 37.85,23.24 U2.7
BOOT0: length 25.6
  Top Layer w0.254: U16.44 7.89,40.02 arc(8.08,40.99) 8.63,41.82 v1(12.19,45.38)
  Inner2 w0.254: v1(12.19,45.38) v1(12.19,47.79)
  Bottom Layer w0.254: 11.05,54.78 11.05,55.41 arc(11.35,56.13) 12.07,56.43 15.11,56.43 arc(15.65,56.2) 15.88,55.67 15.88,53.29 arc(15.68,52.32) 15.13,51.49 12.73,49.09 arc(12.33,48.5) v1(12.19,47.79)
CC1: length 5.1
  Top Layer w0.254: USB1.A5 v1(24.52,9.18) ; v1(26.04,9.95) 26.15,9.95 arc(27.06,10.32) R14.1
  Inner1 w0.254: v1(26.04,9.95) 25.29,9.95 arc(24.75,9.72) v1(24.52,9.18)
CC2: length 12.6
  Top Layer w0.254: v1(30.73,9.69) 30.73,9.83 arc(30.33,10.82) R15.1
  Inner1 w0.254: v1(30.73,9.69) 30.73,5.5 arc(30.55,5.05) 30.1,4.87 26.54,4.87 arc(26.21,5) 26.07,5.34 USB1.B5
DBG_RX: length 20.6
  Top Layer w0.254: v1(6.99,47.79) 6.99,50.17 arc(6.79,51.14) 6.24,51.97 5.97,52.24 ; U16.31 11.47,35.6 arc(10.5,35.79) 9.67,36.34 v1(8.51,37.5)
  Bottom Layer w0.254: v1(6.99,47.79) 6.99,40.08 arc(7.18,39.11) 7.73,38.28 v1(8.51,37.5)
DBG_TX: length 23
  Top Layer w0.254: v1(7.62,36.74) 8.52,35.84 arc(9.35,35.29) 10.32,35.1 U16.30
  Bottom Layer w0.254: v1(7.62,36.74) 7.09,37.27 arc(6.54,38.09) 6.35,39.06 6.35,48.01 arc(6.16,48.98) 5.61,49.81 H3.1
HS_D+: length 30.4
  Top Layer w0.158: U13.10 26.17,23.23 arc(26.15,23.17) 26.12,23.11 arc(26.08,23.06) 26.07,23 26.07,22.9 arc(25.79,22.23) 25.13,21.95 22.15,21.95 arc(20.37,22.69) 19.63,24.47 19.63,37.08 arc(19.61,37.19) 19.55,37.28 arc(19.49,37.37) 19.47,37.47 v1(19.47,37.76) ; U16.33 13.73,36.6 arc(13.79,36.58) 13.84,36.55 arc(13.89,36.51) 13.96,36.5 16.04,36.5 arc(16.04,36.5) 16.05,36.5 arc(16.05,36.49) 16.05,36.49 16.06,36.49 arc(16.18,36.51) 16.28,36.57 arc(16.37,36.63) 16.48,36.65 v1(16.76,36.65)
  Bottom Layer w0.158: v1(16.76,36.65) 17.05,36.65 arc(17.15,36.63) 17.24,36.57 arc(17.33,36.51) 17.44,36.49 19.04,36.49 arc(19.46,36.66) 19.63,37.08 arc(19.61,37.19) 19.55,37.28 arc(19.49,37.37) 19.47,37.47 v1(19.47,37.76)
HS_D-: length 30
  Top Layer w0.158: U16.32 13.73,36.1 arc(13.79,36.11) 13.84,36.14 arc(13.89,36.18) 13.96,36.19 15.73,36.19 arc(15.73,36.19) 15.74,36.19 arc(15.74,36.18) 15.74,36.18 16.09,36.18 arc(16.19,36.16) 16.28,36.1 arc(16.37,36.04) 16.48,36.02 v1(16.76,36.02) ; v1(20.1,37.76) 20.1,37.47 arc(20.08,37.37) 20.02,37.28 arc(19.96,37.19) 19.94,37.08 19.94,24.47 arc(20.59,22.91) 22.15,22.27 25.13,22.27 arc(25.58,22.45) 25.76,22.9 25.76,23 arc(25.75,23.06) 25.71,23.11 arc(25.68,23.17) 25.67,23.23 U13.9
  Bottom Layer w0.158: v1(20.1,37.76) 20.1,37.47 arc(20.08,37.37) 20.02,37.28 arc(19.96,37.19) 19.94,37.08 arc(19.67,36.44) 19.04,36.18 17.44,36.18 arc(17.33,36.16) 17.24,36.1 arc(17.15,36.04) 17.05,36.02 v1(16.76,36.02)
MUX_EN: length 65.6
  Top Layer w0.152: v1(27.31,28.87) 25.6,27.16 arc(25.1,26.83) v1(24.51,26.71) ; U3.2 44.51,38.89 arc(44.6,39.31) v1(44.83,39.66)
  Top Layer w0.254: v1(22.54,31.85) 23.9,30.5 arc(24.3,30.23) 24.77,30.14 26.04,30.14 arc(26.93,29.77) v1(27.31,28.87) ; U16.27 17.5,33.6 arc(18.2,33.46) v1(18.8,33.06)
  Inner2 w0.254: v1(10.16,23.15) 7.78,23.15 arc(6.81,22.96) 5.99,22.41 H4.3
  Inner2 w0.305: v1(36.96,34.2) 42.26,34.2 arc(43.23,34.4) 44.05,34.95 44.09,34.98 arc(44.64,35.81) 44.83,36.78 v1(44.83,39.66)
  Bottom Layer w0.152: v1(27.31,28.87) 31.9,33.46 arc(32.72,34.01) 33.69,34.2 v1(36.96,34.2) ; v1(24.51,26.71) 23.93,26.13 arc(23.73,25.99) 23.5,25.95 arc(23.26,25.9) 23.06,25.77 21.45,24.15 arc(21.29,23.98) 21.15,23.8 arc(20.43,23.32) 19.59,23.15 v1(10.16,23.15)
  Bottom Layer w0.254: v1(22.54,31.85) 22.08,32.32 arc(21.26,32.87) 20.28,33.06 v1(18.8,33.06)
PWR_LED:
  vias: v1(8.93,26.33)
RD_D+: length 13.2
  Top Layer w0.158: U2.32 33.56,24.34 arc(33.49,24.36) 33.44,24.39 arc(33.39,24.43) 33.33,24.44 32.33,24.44 arc(32.22,24.42) 32.13,24.36 arc(32.04,24.3) 31.94,24.28 v1(31.5,24.28) ; U13.8 24.97,24.31 arc(24.89,24.33) 24.82,24.37 arc(24.74,24.42) 24.66,24.44 23.95,24.44 arc(23.84,24.42) 23.75,24.36 arc(23.66,24.3) 23.56,24.28 v1(23.11,24.28)
  Bottom Layer w0.158: v1(31.5,24.28) 31.05,24.28 arc(30.95,24.3) 30.86,24.36 arc(30.77,24.42) 30.66,24.44 23.95,24.44 arc(23.84,24.42) 23.75,24.36 arc(23.66,24.3) 23.56,24.28 v1(23.11,24.28)
RD_D-: length 13.2
  Top Layer w0.158: U2.31 33.56,24.84 arc(33.49,24.83) 33.44,24.8 arc(33.39,24.76) 33.33,24.75 32.33,24.75 arc(32.22,24.77) 32.13,24.83 arc(32.04,24.89) 31.94,24.91 v1(31.5,24.91) ; v1(23.11,24.91) 23.56,24.91 arc(23.66,24.89) 23.75,24.83 arc(23.84,24.77) 23.95,24.75 24.78,24.75 arc(24.82,24.76) 24.85,24.78 arc(24.88,24.8) 24.92,24.81 U13.7
  Bottom Layer w0.158: v1(23.11,24.91) 23.56,24.91 arc(23.66,24.89) 23.75,24.83 arc(23.84,24.77) 23.95,24.75 30.66,24.75 arc(30.77,24.77) 30.86,24.83 arc(30.95,24.89) 31.05,24.91 v1(31.5,24.91)
RD_RX+: length 26.4
  Top Layer w0.158: v1(32.09,19.76) 32.53,19.76 arc(32.64,19.74) 32.73,19.68 arc(32.82,19.62) 32.92,19.6 33.88,19.6 arc(34.73,19.77) 35.45,20.25 36.07,20.87 arc(36.35,21.29) 36.45,21.79 36.45,22.82 arc(36.44,22.88) 36.4,22.93 arc(36.37,22.98) 36.35,23.05 U2.4
  Bottom Layer w0.158: v1(32.09,19.76) 31.76,19.76 arc(31.55,19.72) 31.37,19.6 29.88,19.6 arc(28.91,19.4) 28.09,18.85 23.86,14.63 arc(23.31,13.81) 23.12,12.83 23.12,7.15 arc(23.09,7) 23,6.87 arc(22.98,6.66) 22.87,6.48 USB1.B11
RD_RX-: length 26.4
  Top Layer w0.158: v1(32.09,19.13) 32.53,19.13 arc(32.64,19.15) 32.73,19.21 arc(32.82,19.27) 32.92,19.29 33.88,19.29 arc(34.85,19.48) 35.67,20.03 36.29,20.65 arc(36.64,21.17) 36.76,21.79 36.76,22.82 arc(36.77,22.88) 36.81,22.93 arc(36.84,22.98) 36.85,23.05 U2.5
  Bottom Layer w0.158: v1(32.09,19.13) 31.76,19.13 arc(31.55,19.17) 31.37,19.29 29.88,19.29 arc(29.03,19.12) 28.3,18.63 24.08,14.41 arc(23.6,13.69) 23.43,12.83 23.43,7.15 arc(23.46,7) 23.54,6.87 arc(23.57,6.66) 23.67,6.48 USB1.B10
RD_TX+: length 8
  Top Layer w0.158: USB1.A2 23.02,9.02 arc(23.04,9.09) 23.07,9.14 arc(23.11,9.19) 23.12,9.25 23.12,15.08 arc(23.02,15.58) C15.1
RD_TX-: length 8
  Top Layer w0.158: USB1.A3 23.52,9.02 arc(23.51,9.09) 23.48,9.14 arc(23.44,9.19) 23.43,9.25 23.43,15.05 arc(23.53,15.56) C16.1
SD_HOST_LED:
  vias: v1(8.29,26.33)
SD_TS_LED:
  vias: v1(7.66,26.33)
SEL0: length 60.7
  Top Layer w0.152: v1(21.78,23.34) 21.51,23.62 arc(21.45,23.7) 21.43,23.8 arc(21.41,23.88) 21.37,23.95 20.7,24.62 arc(20.51,24.9) 20.45,25.23 20.45,25.4 arc(20.46,25.47) 20.5,25.53 arc(20.54,25.58) 20.55,25.65 20.55,25.68 arc(20.57,25.77) 20.62,25.84 v1(20.9,26.12) ; v1(25.75,29.28) 25.47,29 arc(25.42,28.93) 25.4,28.84 arc(25.38,28.75) 25.33,28.67 25.19,28.53 arc(24.41,28.01) 23.5,27.83 23.08,27.83 arc(22.97,27.81) 22.88,27.75 arc(22.79,27.69) 22.68,27.67 arc(22.57,27.64) 22.48,27.58 v1(22.23,27.34) ; v1(27.53,31.06) 27.81,31.34 arc(27.88,31.39) 27.97,31.41 arc(28.06,31.43) 28.14,31.48 35.76,39.1 arc(35.96,39.24) 36.2,39.28 36.83,39.28 arc(37.31,39.08) 37.51,38.6 U3.16
  Top Layer w0.254: U16.26 16.06,33.1 arc(17.03,32.9) 17.85,32.35 18.42,31.79 arc(18.6,31.51) 18.67,31.18 v1(18.67,27.22)
  Inner2 w0.254: v1(9.65,17.31) 6.33,17.31 arc(6,17.25) H4.1 ; v1(22.35,20.23) 22.35,20.14 arc(22.25,19.64) 21.97,19.22 arc(21.69,19.03) 21.36,18.96 v1(14.22,18.96)
  Bottom Layer w0.152: v1(25.75,29.28) 26.03,29.57 arc(26.11,29.62) 26.2,29.63 arc(26.29,29.65) 26.36,29.7 27.11,30.45 arc(27.16,30.52) 27.18,30.61 arc(27.19,30.7) 27.24,30.78 v1(27.53,31.06) ; v1(22.23,27.34) 21.95,27.06 arc(21.9,26.98) 21.88,26.89 arc(21.87,26.8) 21.81,26.72 21.62,26.53 arc(21.5,26.45) 21.35,26.42 arc(21.21,26.39) 21.08,26.31 v1(20.9,26.12) ; v1(22.35,20.23) 22.35,22.77 arc(22.19,23.18) v1(21.78,23.34)
  Bottom Layer w0.254: v1(14.22,18.96) 12.36,18.96 arc(11.38,18.77) 10.56,18.22 v1(9.65,17.31) ; v1(20.9,26.12) 20.82,26.12 arc(19.84,26.32) 19.02,26.87 v1(18.67,27.22)
SEL1: length 61.8
  Top Layer w0.152: U3.17 36.16,38.49 arc(35.7,38.4) 35.31,38.14 28.39,31.23 arc(28.34,31.15) 28.32,31.06 arc(28.31,30.97) 28.26,30.89 v1(27.97,30.61) ; 22.69,18.91 21.49,17.71 arc(21.19,17.51) v1(20.83,17.44) ; 22.69,18.91 arc(22.67,18.89) 22.66,18.88 ; 22.69,18.91 arc(22.82,19.11) 22.86,19.34 v1(22.86,20.87) ; v1(22.68,26.89) 22.98,27.18 arc(23.03,27.27) 23.05,27.37 arc(23.06,27.41) 23.08,27.44 arc(23.12,27.46) 23.16,27.47 23.59,27.47 arc(24.56,27.67) 25.38,28.22 25.58,28.42 arc(25.66,28.47) 25.75,28.48 arc(25.84,28.5) 25.92,28.55 v1(26.2,28.83) ; v1(21.37,25.7) 21.07,25.39 arc(20.99,25.34) 20.9,25.32 arc(20.84,25.29) 20.81,25.23 arc(20.84,25.04) 20.95,24.87 21.62,24.2 arc(21.69,24.16) 21.77,24.14 arc(21.87,24.12) 21.96,24.06 v1(22.23,23.79)
  Top Layer w0.254: U16.25 15.43,32.6 arc(16.15,32.45) 16.76,32.04 17.04,31.77 arc(17.59,30.95) 17.78,29.98 v1(17.78,26.96)
  Inner2 w0.254: v1(9.4,20.49) 9.25,20.34 arc(8.43,19.79) 7.46,19.6 H4.2
  Bottom Layer w0.152: v1(27.97,30.61) 27.69,30.33 arc(27.62,30.28) 27.53,30.26 arc(27.44,30.25) 27.36,30.19 26.62,29.45 arc(26.56,29.37) 26.55,29.28 arc(26.53,29.19) 26.48,29.12 v1(26.2,28.83) ; v1(21.37,25.7) 21.74,26.06 arc(21.76,26.09) 21.76,26.12 arc(21.77,26.16) 21.79,26.19 22.07,26.47 arc(22.14,26.52) 22.23,26.54 arc(22.33,26.56) 22.4,26.61 v1(22.68,26.89) ; v1(20.83,17.44) 18.52,19.74 arc(17.7,20.29) 16.73,20.49 v1(9.4,20.49) ; v1(22.23,23.79) arc(22.59,23.64) 22.73,23.29 22.73,21 arc(22.77,20.91) v1(22.86,20.87)
  Bottom Layer w0.254: v1(17.78,26.96) 18.86,25.89 arc(19.35,25.56) 19.94,25.44 20.75,25.44 arc(21.09,25.51) v1(21.37,25.7)
SER_D+: length 23.5
  Top Layer w0.158: U13.6 24.43,25.31 arc(24.37,25.32) 24.31,25.36 arc(24.26,25.39) 24.2,25.4 23.62,25.4 arc(21.97,26.09) 21.28,27.75 21.28,42.84 arc(20.97,43.58) 20.23,43.89 19.47,43.89 arc(19.41,43.88) 19.36,43.85 arc(19.3,43.81) 19.24,43.8 U14.4
SER_D-: length 23.5
  Top Layer w0.158: U14.5 19.24,44.3 arc(19.3,44.29) 19.36,44.25 arc(19.41,44.22) 19.47,44.2 20.23,44.2 arc(21.19,43.8) 21.59,42.84 21.59,27.75 arc(22.19,26.31) 23.62,25.71 24.2,25.71 arc(24.26,25.73) 24.31,25.76 arc(24.37,25.8) 24.43,25.81 U13.5
SPI_CK: length 17
  Top Layer w0.254: U5.6 43.18,23.41 arc(42.47,25.11) 40.77,25.82 39.03,25.82 arc(39.02,25.83) U2.12
SPI_CS: length 26.1
  Top Layer w0.254: U5.1 40.64,8.68 arc(40.86,9.21) 41.4,9.44 42.8,9.44 arc(43.52,9.74) 43.82,10.45 43.82,23.8 arc(43.07,25.6) 41.28,26.34 U2.13
SPI_MISO: length 20.7
  Top Layer w0.254: v2(42.55,8.42) 42.55,7.94 arc(42.38,7.11) U5.2 ; U2.10 39.2,24.84 arc(39.91,24.7) 40.51,24.3 40.57,24.24 arc(41.07,23.91) v2(41.66,23.79)
  Bottom Layer w0.254: v2(41.66,23.79) 41.8,23.64 arc(42.35,22.82) 42.55,21.85 v2(42.55,8.42)
SPI_MOSI: length 17.4
  Top Layer w0.254: v2(44.45,21.5) U5.5 ; U2.11 40.16,25.34 arc(40.69,25.24) v2(41.15,24.93)
  Bottom Layer w0.254: v2(41.15,24.93) 41.91,24.93 arc(43.71,24.19) 44.45,22.39 v2(44.45,21.5)
SWCLK: length 34
  Top Layer w0.254: v1(20.07,39.41) 11.84,39.41 arc(11.59,39.46) U16.37
  Inner1 w0.254: v1(14.99,49.44) 14.99,52.59 arc(14.89,53.08) v1(14.61,53.51)
  Inner2 w0.254: v1(20.07,39.41) 15.73,43.75 arc(15.18,44.57) 14.99,45.54 v1(14.99,49.44)
  Bottom Layer w0.254: 5.97,54.78 6.5,54.25 arc(7.32,53.7) 8.29,53.51 v1(14.61,53.51)
SWDIO: length 40.2
  Top Layer w0.254: v1(19.47,38.65) 19.32,38.5 arc(18.5,37.95) 17.53,37.76 17.1,37.76 arc(16.44,37.63) 15.88,37.25 arc(15.7,37.14) 15.5,37.1 U16.34 ; v1(12.95,47.41) 12.95,47.76 arc(13.15,48.73) 13.7,49.55 14.62,50.48 arc(15.17,51.3) 15.37,52.27 15.37,55.25 arc(15.27,55.75) 14.99,56.17 arc(14.71,56.36) 14.37,56.43 6.13,56.43 arc(5.16,56.23) 4.34,55.68 3.43,54.78
  Inner2 w0.254: v1(19.47,38.65) 13.7,44.42 arc(13.15,45.24) 12.95,46.22 v1(12.95,47.41)
TF_CLK: length 7.6
  Top Layer w0.158: U3.7 42.01,39.19 arc(41.92,39.65) 41.66,40.05 41.07,40.63 arc(40.94,40.83) 40.89,41.06 40.89,41.38 arc(40.86,41.47) 40.77,41.5 40.29,41.5 arc(40.17,41.63) 40.29,41.76 41.5,41.76 arc(41.62,41.88) 41.5,42.01 41.02,42.01 arc(40.93,42.05) 40.89,42.14 40.89,43.11 arc(40.89,43.12) 40.89,43.13
TF_CMD: length 7.6
  Top Layer w0.158: U3.8 41.51,38.5 arc(41.32,39.47) 40.77,40.3 40.64,40.43 arc(40.36,40.61) 40.03,40.68 39.12,40.68 arc(38.81,40.81) 38.69,41.11 38.69,41.56 arc(38.72,41.65) 38.81,41.69 39.24,41.69 arc(39.37,41.81) 39.24,41.94 38.81,41.94 arc(38.72,41.98) 38.69,42.07 CARD1.3
TF_DAT0: length 7.5
  Top Layer w0.158: CARD1.7 43.09,42.04 arc(43.12,41.95) 43.21,41.91 43.73,41.91 arc(43.86,41.79) 43.73,41.66 42.44,41.66 arc(42.32,41.53) 42.44,41.4 42.96,41.4 arc(43.05,41.37) 43.09,41.28 43.09,40.99 arc(43.01,40.62) 42.8,40.3 42.76,40.26 arc(42.58,39.98) 42.51,39.66 U3.6
TF_DAT1: length 7.6
  Top Layer w0.158: U3.5 43.01,38.98 arc(43.22,39.5) 43.74,39.71 arc(44.14,39.88) 44.31,40.28 44.31,40.93 arc(44.34,41.02) 44.43,41.06 44.9,41.06 arc(45.03,41.19) 44.9,41.31 44.43,41.31 arc(44.31,41.44) 44.43,41.57 44.9,41.57 arc(45.03,41.69) 44.9,41.82 44.43,41.82 arc(44.34,41.86) 44.31,41.95 44.31,42.62 arc(44.28,42.74) 44.22,42.84
TF_DAT2: length 7.5
  Top Layer w0.158: CARD1.1 36.49,40.39 arc(36.74,39.79) 37.34,39.54 39.38,39.54 arc(39.83,39.35) 40.01,38.9 U3.11
TF_DAT3: length 7.7
  Top Layer w0.158: CARD1.2 37.59,41.9 arc(37.55,41.81) 37.46,41.77 37.21,41.77 arc(37.08,41.64) 37.21,41.52 37.46,41.52 arc(37.55,41.48) 37.59,41.39 37.59,40.69 arc(37.74,40.32) 38.1,40.17 39.5,40.17 arc(40.22,39.87) 40.51,39.16 40.51,38.49
TF_VCC: length 56.6
  Top Layer w0.508: D3.1 25.14,43.82 arc(25.34,44.79) 25.89,45.61 26.31,46.03 arc(27.13,46.58) 28.1,46.78 v2(34.8,46.78) v2(36.35,46.78) 36.67,46.78 arc(37.64,46.58) 38.46,46.03 39.04,45.45 arc(39.59,44.63) 39.79,43.66 39.79,43.13
  Bottom Layer w0.508: v2(34.8,46.78) v2(36.35,46.78) 38.61,46.78 arc(40.31,46.12) 41.14,44.49 ; U9.4 50.95,33.02 arc(49.98,33.21) 49.15,33.76 41.88,41.03 arc(41.33,41.86) 41.14,42.83 41.14,44.49 ; 41.14,44.49 arc(41.15,44.36) 41.15,44.24
TS_CLK: length 20.1
  Top Layer w0.158: U3.36 44.01,34.7 arc(44.09,34.29) 44.32,33.95 44.98,33.3 arc(45.8,32.75) 46.77,32.55 51.78,32.55 arc(52.75,32.75) 53.58,33.3 54.07,33.79 arc(54.43,34.03) 54.86,34.12 55.19,34.12 arc(55.28,34.16) 55.32,34.25 55.32,34.42 arc(55.45,34.55) 55.58,34.42 55.58,33.82 arc(55.7,33.69) 55.83,33.82 55.83,34.42 arc(55.96,34.55) 56.08,34.42 56.08,33.82 arc(56.21,33.69) 56.34,33.82 56.34,33.99 arc(56.37,34.08) 56.46,34.12 v2(56.77,34.12)
  Bottom Layer w0.158: U9.5 v2(56.77,34.12)
TS_CMD: length 20
  Top Layer w0.158: v2(56.77,31.92) 51.96,31.92 arc(51.87,31.88) 51.83,31.79 51.83,31.62 arc(51.7,31.49) 51.57,31.62 51.57,31.79 arc(51.45,31.92) 51.32,31.79 51.32,31.62 arc(51.19,31.49) 51.07,31.62 51.07,31.79 arc(50.94,31.92) 50.81,31.79 50.81,31.62 arc(50.69,31.49) 50.56,31.62 50.56,31.79 arc(50.43,31.92) 50.3,31.79 50.3,31.62 arc(50.18,31.49) 50.05,31.62 50.05,31.79 arc(50.01,31.88) 49.92,31.92 46.77,31.92 arc(45.8,32.11) 44.98,32.66 44.07,33.57 arc(43.66,34.19) 43.51,34.91 U3.35
  Bottom Layer w0.158: U9.3 v2(56.77,31.92)
TS_DAT0: length 20.1
  Top Layer w0.158: U3.37 44.51,34.71 arc(44.57,34.42) 44.73,34.17 45.09,33.82 arc(45.65,33.45) 46.31,33.31 48.52,33.31 arc(48.61,33.35) 48.64,33.44 48.64,33.85 arc(48.77,33.98) 48.9,33.85 48.9,33.44 arc(49.02,33.31) 49.15,33.44 49.15,33.85 arc(49.28,33.98) 49.41,33.85 49.41,33.44 arc(49.53,33.31) 49.66,33.44 49.66,33.85 arc(49.79,33.98) 49.91,33.85 49.91,33.44 arc(49.95,33.35) 50.04,33.31 51.78,33.31 arc(52.75,33.51) 53.58,34.06 55.18,35.66 arc(55.91,36.15) v2(56.77,36.32)
  Bottom Layer w0.158: U9.7 v2(56.77,36.32)
TS_DAT1: length 20.1
  Top Layer w0.158: U3.38 45.01,34.71 arc(45.12,34.44) 45.39,34.33 46.58,34.33 arc(47.08,34.43) 47.5,34.71 49.46,36.67 arc(50.29,37.23) 51.26,37.42 51.54,37.42 arc(51.63,37.38) 51.67,37.29 51.67,36.74 arc(51.8,36.61) 51.92,36.74 51.92,37.29 arc(52.05,37.42) 52.18,37.29 52.18,36.74 arc(52.3,36.61) 52.43,36.74 52.43,37.29 arc(52.56,37.42) 52.69,37.29 52.69,36.74 arc(52.81,36.61) 52.94,36.74 52.94,37.29 arc(52.98,37.38) 53.07,37.42 v2(56.77,37.42)
  Bottom Layer w0.158: U9.8 v2(56.77,37.42)
TS_DAT2: length 20.1
  Top Layer w0.158: U3.33 42.51,33.76 arc(42.71,32.79) 43.26,31.97 44.76,30.46 arc(45.59,29.91) 46.56,29.72 v2(56.77,29.72)
  Bottom Layer w0.158: U9.1 v2(56.77,29.72)
TS_DAT3: length 20.1
  Top Layer w0.158: v2(56.77,30.82) 49.45,30.82 arc(49.36,30.85) 49.32,30.94 49.32,31.08 arc(49.19,31.21) 49.07,31.08 49.07,30.55 arc(48.94,30.42) 48.81,30.55 48.81,30.69 arc(48.78,30.78) 48.69,30.82 46.48,30.82 arc(45.5,31.01) 44.68,31.56 43.76,32.48 arc(43.21,33.31) 43.01,34.28 U3.34
  Bottom Layer w0.158: U9.2 v2(56.77,30.82)
TS_RXD: length 20.4
  Top Layer w0.254: U14.25 16.04,40.58 arc(16,40.36) v1(15.88,40.17)
  Bottom Layer w0.254: H2.2 22.36,52.11 arc(21.53,51.94) 20.83,51.47 arc(20.36,50.77) 20.19,49.94 20.19,43.64 arc(20,42.66) 19.45,41.84 17.2,39.59 arc(17,39.46) 16.76,39.41 16.64,39.41 arc(16.1,39.63) v1(15.88,40.17)
TS_TXD: length 20
  Top Layer w0.254: U14.26 16.54,40.7 arc(16.6,40.42) v1(16.76,40.17)
  Bottom Layer w0.254: H2.1 23.45,54.65 arc(22.79,54.52) 22.23,54.14 19.79,51.71 arc(19.24,50.89) 19.05,49.91 19.05,43.51 arc(18.86,42.54) 18.31,41.71 v1(16.76,40.17)
UP_CHO: length 31.2
  Top Layer w0.254: U2.29 v1(31.75,25.84) ; U16.22 10.39,30.31 arc(10.46,29.94) 10.67,29.63 16.51,29.63 arc(16.89,29.07) 17.02,28.4 17.02,26.75 arc(17.21,25.77) 17.76,24.95 v1(18.8,23.92)
  Inner1 w0.254: v1(29.02,23.73) 30.7,25.41 arc(31.18,25.73) v1(31.75,25.84)
  Inner2 w0.254: v1(18.8,23.92) 20.13,22.59 arc(20.62,22.25) 21.21,22.14 21.31,22.14 arc(21.8,22.24) 22.23,22.52 arc(22.79,22.89) 23.45,23.03 v1(23.5,23.03)
  Bottom Layer w0.254: v1(23.5,23.03) 27.33,23.03 arc(28.25,23.21) v1(29.02,23.73)
UP_CLK: length 7.6
  Top Layer w0.158: U2.20 36.85,29.53 arc(37.05,30.5) 37.6,31.33 38.77,32.5 arc(39.32,33.32) 39.51,34.29 U3.27
UP_CMD: length 7.6
  Top Layer w0.158: U3.26 39.01,34.5 arc(38.82,33.53) 38.27,32.7 37.1,31.53 arc(36.55,30.71) 36.35,29.74 U2.21
UP_D+: length 23.7
  Top Layer w0.158: v1(24.45,10.71) 25.05,10.1 arc(25.1,10.03) 25.12,9.95 25.12,9.25 arc(25.11,9.19) 25.07,9.14 arc(25.04,9.09) 25.02,9.02 USB1.A6 ; v1(25.59,14.09) 25.59,14.53 arc(25.57,14.64) 25.51,14.73 arc(25.45,14.82) 25.43,14.93 25.43,16.87 arc(25.6,17.72) 26.08,18.44 26.33,18.69 arc(26.88,19.51) 27.07,20.49 27.07,22.84 arc(27.08,22.9) 27.12,22.96 arc(27.15,23.01) 27.17,23.07 U13.12
  Inner1 w0.158: v1(24.45,10.71) 25.02,11.28 arc(25.51,11.61) v1(26.09,11.72)
  Bottom Layer w0.158: 25.43,12.92 25.43,7.86 arc(25.46,7.7) 25.55,7.56 arc(25.64,7.43) 25.67,7.27 USB1.B6 ; 25.43,12.92 25.43,13.38 arc(25.55,13.56) 25.59,13.77 v1(25.59,14.09) ; 25.43,12.92 arc(25.53,12.43) 25.8,12.01 v1(26.09,11.72)
UP_D-: length 23.7
  Top Layer w0.158: v1(26.09,10.71) 25.5,10.12 arc(25.45,10.04) 25.43,9.95 25.43,9.25 arc(25.44,9.19) 25.48,9.14 arc(25.51,9.09) 25.52,9.02 USB1.A7 ; U13.11 26.67,23.07 arc(26.68,23.01) 26.71,22.96 arc(26.75,22.9) 26.76,22.84 26.76,20.49 arc(26.59,19.63) 26.11,18.91 25.86,18.66 arc(25.31,17.84) 25.12,16.87 25.12,14.93 arc(25.1,14.82) 25.04,14.73 arc(24.98,14.64) 24.96,14.53 v1(24.96,14.09)
  Inner2 w0.158: v1(26.09,10.71) 25.51,11.29 arc(25.02,11.61) v1(24.45,11.72)
  Bottom Layer w0.158: USB1.B7 24.87,7.27 arc(24.91,7.43) 25,7.56 arc(25.09,7.7) 25.12,7.86 25.12,12.92 ; 25.12,12.92 25.12,13.38 arc(25,13.55) 24.96,13.77 v1(24.96,14.09) ; 25.12,12.92 arc(25.02,12.43) 24.74,12.01 v1(24.45,11.72)
UP_DAT0: length 7.6
  Top Layer w0.158: U2.19 37.35,29.32 arc(37.55,30.29) 38.1,31.12 39.27,32.29 arc(39.82,33.11) 40.01,34.08 U3.28
UP_DAT1: length 7.6
  Top Layer w0.158: U3.29 40.51,33.88 arc(40.32,32.9) 39.77,32.08 38.6,30.91 ; U2.18 37.85,29.11 arc(38.05,30.09) 38.6,30.91
UP_DAT2: length 7.6
  Top Layer w0.158: U3.24 38.01,34.91 arc(37.82,33.94) 37.27,33.12 36.1,31.95 arc(35.55,31.12) 35.35,30.15 U2.23
UP_DAT3: length 7.6
  Top Layer w0.158: U2.22 35.85,29.94 arc(36.05,30.91) 36.6,31.74 37.77,32.91 arc(38.32,33.73) 38.51,34.71 U3.25
UP_LED: length 38.9
  Top Layer w0.254: U2.14 v1(41.91,26.84) ; v1(7.49,28.11) 7.75,28.11 arc(8.21,28.02) LED5.1
  Inner2 w0.254: v1(32.26,28.11) 32.78,27.59 arc(33.6,27.04) 34.57,26.84 v1(41.91,26.84)
  Bottom Layer w0.254: v1(32.26,28.11) v1(7.49,28.11)
UP_VCC: length 11.6
  Top Layer w0.254: D3.2 27.1,30.52 arc(27.66,30.14) 28.32,30.01 29.14,30.01 arc(29.4,30.08) 29.67,30.01 30.48,30.01 arc(30.6,29.99) 30.7,29.92 31.62,29 31.62,28.36 arc(31.92,27.64) 32.64,27.34 34.19,27.34 arc(34.2,27.34) U2.26
$1N442: length 9.1
  Top Layer w0.254: U2.9 39.01,24.15 arc(39.1,23.68) v1(39.37,23.28) ; R1.2 44.96,24.1 arc(44.93,23.93) v1(44.83,23.79)
  Inner2 w0.254: v1(44.83,23.79) 44.43,23.39 arc(43.61,22.84) 42.64,22.65 40.89,22.65 arc(40.07,22.81) 39.38,23.27 v1(39.37,23.28)
$1N465: length 16.6
  Top Layer w0.158: C16.2 23.83,17.53 arc(23.77,17.78) 23.63,18 arc(23.49,18.22) 23.43,18.47 arc(23.53,18.93) 23.79,19.32 24.22,19.76 arc(24.29,19.81) 24.38,19.82 arc(24.5,19.85) 24.61,19.92 v1(24.91,20.22) ; U2.2 35.35,23.05 arc(35.34,22.98) 35.31,22.93 arc(35.27,22.88) 35.26,22.82 35.26,22.52 arc(35.06,22.03) 34.57,21.83 31.31,21.83 arc(31.21,21.81) 31.12,21.75 arc(31.03,21.69) 30.92,21.67 v1(30.48,21.67)
  Bottom Layer w0.158: v1(24.91,20.22) 25.22,20.53 arc(25.28,20.62) 25.3,20.72 arc(25.32,20.83) 25.38,20.92 25.64,21.17 arc(26.36,21.66) 27.21,21.83 29.65,21.83 arc(29.75,21.81) 29.84,21.75 arc(29.93,21.69) 30.04,21.67 v1(30.48,21.67)
$1N466: length 16.6
  Top Layer w0.158: U2.1 34.85,23.05 arc(34.87,22.98) 34.9,22.93 arc(34.94,22.88) 34.95,22.82 34.95,22.52 arc(34.84,22.25) 34.57,22.14 31.31,22.14 arc(31.21,22.16) 31.12,22.22 arc(31.03,22.28) 30.92,22.3 v1(30.48,22.3) ; v1(24.46,20.67) 24.17,20.37 arc(24.09,20.26) 24.07,20.13 arc(24.05,20.05) 24,19.98 23.57,19.54 arc(23.24,19.05) 23.12,18.47 arc(23.07,18.22) 22.93,18 arc(22.78,17.78) 22.73,17.53 C15.2
  Bottom Layer w0.158: v1(24.46,20.67) 24.77,20.98 arc(24.86,21.04) 24.97,21.06 arc(25.07,21.08) 25.16,21.14 25.42,21.39 arc(26.24,21.94) 27.21,22.14 29.65,22.14 arc(29.75,22.16) 29.84,22.22 arc(29.93,22.28) 30.04,22.3 v1(30.48,22.3)
$1N469: length 2.8
  Top Layer w0.254: U2.24 34.85,29.23 arc(34.48,30.14) C36.1
$1N1150: length 3.2
  Top Layer w0.254: LED5.2 R13.1
$1N2251: length 4.9
  Top Layer w0.254: U5.7 41.91,11.25 arc(41.81,10.75) 41.53,10.33 arc(41.25,10.14) 40.92,10.07 R3.1
$1N2254: length 2.6
  Top Layer w0.254: R4.2 U5.3
$1N4322: length 2.6
  Top Layer w0.254: X8.3 27.83,27.63 arc(27.01,27.29) U13.2
$1N4433: length 3.2
  Top Layer w0.254: R16.2 10.41,24.93 arc(10.32,24.95) LED6.2
$1N4439: length 19.1
  Top Layer w0.254: v1(29.72,25.69) 29.72,25.67 arc(29.65,25.34) 29.46,25.06 arc(29.19,24.87) 28.86,24.81 U13.14 ; R16.1 v1(16.13,24.93)
  Bottom Layer w0.254: v1(16.13,24.93) 20.41,24.93 arc(21.38,25.13) 22.21,25.68 23.39,26.86 arc(24.21,27.41) 25.18,27.6 27.81,27.6 arc(28.52,27.46) 29.11,27.06 29.34,26.84 arc(29.62,26.41) 29.72,25.92 v1(29.72,25.69)
$1N5720: length 2
  Top Layer w0.254: U14.11 16.04,48.25 arc(16.03,48.29) R6.2
$1N5721: length 2.5
  Top Layer w0.254: U14.9 17.04,47.43 arc(17.3,48.04) R7.1
$1N8737: length 12
  Top Layer w0.254: U16.6 3.18,35.6 arc(1.38,36.34) 0.64,38.14 0.64,40.55 arc(0.78,41.3) 1.21,41.93 X6.3 1.82,44.44 arc(1.83,44.48) C48.1
$1N8742: length 8.4
  Top Layer w0.254: U16.5 3.19,36.1 arc(2.82,36.25) 2.67,36.62 2.67,38.44 arc(2.86,39.41) 3.41,40.24 X6.1 4.27,40.34 arc(5.02,40.65) C47.1

## Copper pours and planes (outline as drawn; the poured copper is in the pictures)
GND on Top Layer: -13.33,70.14 54.1,70.14 54.1,-22.57 -13.33,-22.57
GND on Bottom Layer: -9.52,62.27 52.96,62.27 52.96,-6.31 -9.52,-6.31
GND on Inner1: -8.25,65.7 53.47,65.7 53.47,-17.49 -8.25,-17.49
GND on Inner2: -4.06,65.7 52.96,65.7 52.96,-6.94 -4.06,-6.94
VCC on Top Layer: 45.01,38.91 46.76,38.91 46.76,38.16 45.01,38.16

## Text on the board
Bottom Silkscreen Layer: Made By Rath & LingWang @ 2025 with ♥️~ / TF_MUX v0.0.5-rc1
Top Silkscreen Layer: SWDIO / SWCLK / GND / BOOT0 / VCC | TX / RX / GND / 1V2 / 5V | EN / SEL1 / SEL0 | CONN | HUB
